# EAGLE design untitled (EAGLE 9.6.2)
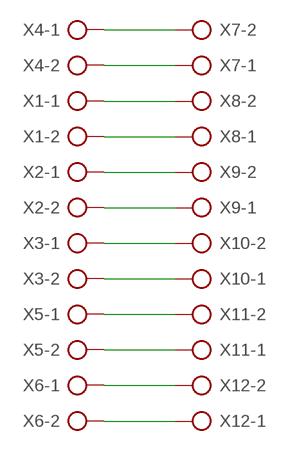
[diagram p0: schematic, sheet 1]

## Parts
X1  AK500/2-H  [AK500/2-H]
X2  AK500/2-H  [AK500/2-H]
X3  AK500/2-H  [AK500/2-H]
X4  AK500/2-H  [AK500/2-H]
X5  AK500/2-H  [AK500/2-H]
X6  AK500/2-H  [AK500/2-H]
X7  AK500/2-H  [AK500/2-H]
X8  AK500/2-H  [AK500/2-H]
X9  AK500/2-H  [AK500/2-H]
X10  AK500/2-H  [AK500/2-H]
X11  AK500/2-H  [AK500/2-H]
X12  AK500/2-H  [AK500/2-H]

## Nets
N$1: X4.1 X7.2
N$2: X4.2 X7.1
N$3: X1.1 X8.2
N$4: X1.2 X8.1
N$5: X2.1 X9.2
N$6: X2.2 X9.1
N$7: X3.1 X10.2
N$8: X3.2 X10.1
N$9: X5.1 X11.2
N$10: X5.2 X11.1
N$11: X6.1 X12.2
N$12: X6.2 X12.1

## Library data of the parts
X1-X12 = con-ptr500:AK500/2-H: CONNECTOR Aug. 2004 / PTR Meßtechnik: Die Bezeichnung der Serie AK505 wurde geändert. Es handelt sich hierbei um AK500 in horizontaler Ausführung.; OC_FARNELL: unknown; OC_NEWARK: unknown

## Board
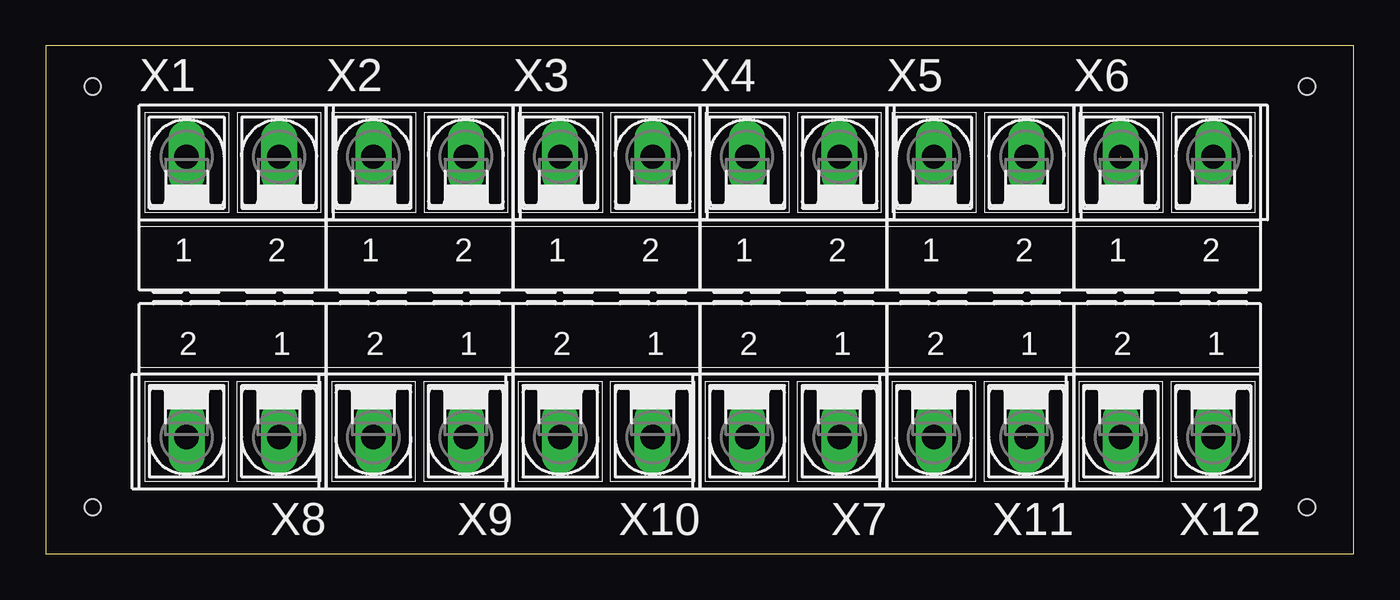
[diagram p1: board, top side]
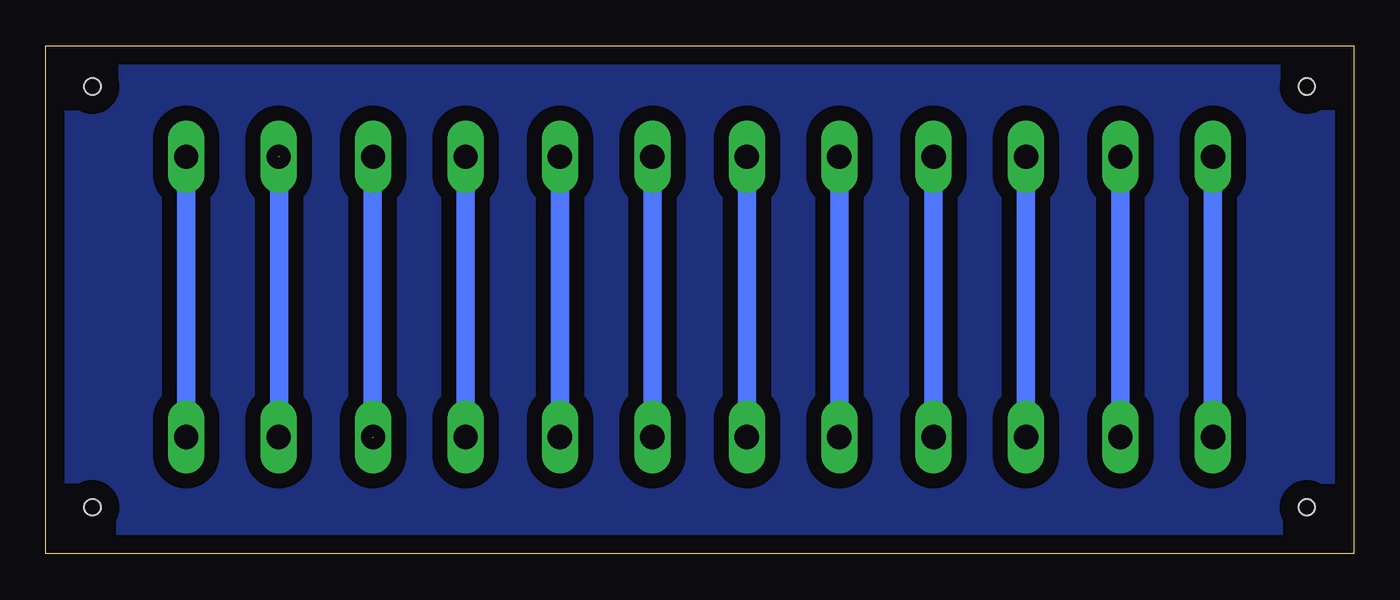
[diagram p2: board, bottom side, seen from below]

Size 71.1 x 27.61 mm. Coordinates in mm from the lower left corner, seen from the top.
Outline: 0,0 71.1,0 71.1,27.61 0,27.61 0,0
Copper layers (1*16): Top 0.035mm / dielectric 1.5mm / Bottom 0.035mm
Design rules "default": minimum track width 6mil, minimum drill 0.35mm, track to track 6mil, track to pad 6mil, pad to pad 6mil, via to via 6mil, smd to smd 6mil, copper to edge 40mil, drill to drill 6mil, minimum pad ring 10mil, minimum via ring 8mil, stop-mask expansion 4mil, vias tented up to drill 0mil, thermal gap 10mil
Holes 0.9 mm at 2.54,25.4 2.54,2.54 68.58,2.54 68.58,25.4

### Footprints (pad centres in the part's own frame; a part is rotated, then mirrored left to right if it is on the bottom)
AK500/2-H = drill 1.321 long: 1 -2.515,0; 2 2.515,0

### Placement (x,y rotation side)
X1  10.16,21.59 0 top
X2  20.32,21.59 0 top
X3  30.48,21.59 0 top
X4  40.64,21.59 0 top
X5  50.8,21.59 0 top
X6  60.96,21.59 0 top
X7  40.64,6.35 180 top
X8  10.16,6.35 180 top
X9  20.32,6.35 180 top
X10  30.48,6.35 180 top
X11  50.8,6.35 180 top
X12  60.96,6.35 180 top

### Tracks (layer width: path | path; a pad name or v marks a point on that pad's centre or on a via)
F
  pour Bottom (isolate 0.813): 0,26.67 0,0 71.12,0 71.12,27.94 0,27.94
N$1
  Bottom 1.016: X4.1 X7.2
N$2
  Bottom 1.016: X4.2 X7.1
N$3
  Bottom 1.016: X1.1 X8.2
N$4
  Bottom 1.016: X1.2 X8.1
N$5
  Bottom 1.016: X2.1 X9.2
N$6
  Bottom 1.016: X2.2 X9.1
N$7
  Bottom 1.016: X3.1 X10.2
N$8
  Bottom 1.016: X3.2 X10.1
N$9
  Bottom 1.016: X5.1 X11.2
N$10  (1 unrouted)
  Bottom 1.016: X5.2 53.34,21.56 53.34,6.35
N$11  (1 unrouted)
  Bottom 1.016: X12.2 58.42,6.38 58.42,21.59
N$12
  Bottom 1.016: X6.2 X12.1